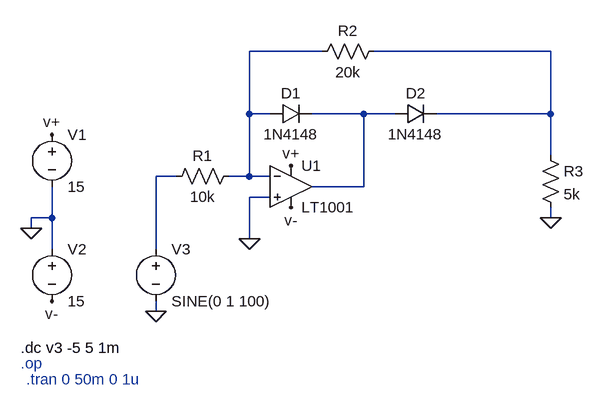
[diagram p0: schematic rectificador con ganancia.asc]
rectificador con ganancia.asc, the LTspice schematic file:
Version 4
SHEET 1 924 680
WIRE 304 -64 192 -64
WIRE 656 -64 384 -64
WIRE 192 32 192 -64
WIRE 224 32 192 32
WIRE 368 32 288 32
WIRE 416 32 368 32
WIRE 656 32 656 -64
WIRE 656 32 480 32
WIRE 656 96 656 32
WIRE 80 128 48 128
WIRE 192 128 192 32
WIRE 192 128 160 128
WIRE 224 128 192 128
WIRE 368 144 368 32
WIRE 368 144 288 144
WIRE 224 160 192 160
WIRE -112 192 -112 144
WIRE -112 192 -144 192
WIRE 656 192 656 176
WIRE -144 208 -144 192
WIRE 192 224 192 160
WIRE -112 240 -112 192
WIRE 48 240 48 128
WIRE 48 336 48 320
FLAG -144 208 0
FLAG -112 64 v+
FLAG -112 320 v-
FLAG 256 176 v-
FLAG 256 112 v+
FLAG 48 336 0
FLAG 656 192 0
FLAG 192 224 0
DATAFLAG 656 32 ""
SYMBOL OpAmps\\LT1001 256 80 R0
SYMATTR InstName U1
SYMBOL voltage -112 48 R0
WINDOW 123 0 0 Left 0
WINDOW 39 0 0 Left 0
SYMATTR InstName V1
SYMATTR Value 15
SYMBOL voltage -112 224 R0
WINDOW 123 0 0 Left 0
WINDOW 39 0 0 Left 0
SYMATTR InstName V2
SYMATTR Value 15
SYMBOL voltage 48 224 R0
WINDOW 123 0 0 Left 0
WINDOW 39 0 0 Left 0
SYMATTR InstName V3
SYMATTR Value SINE(0 1 100)
SYMBOL res 176 112 R90
WINDOW 0 0 56 VBottom 2
WINDOW 3 32 56 VTop 2
SYMATTR InstName R1
SYMATTR Value 10k
SYMBOL res 400 -80 R90
WINDOW 0 0 56 VBottom 2
WINDOW 3 32 56 VTop 2
SYMATTR InstName R2
SYMATTR Value 20k
SYMBOL diode 224 48 R270
WINDOW 0 32 32 VTop 2
WINDOW 3 0 32 VBottom 2
SYMATTR InstName D1
SYMATTR Value 1N4148
SYMBOL diode 416 48 R270
WINDOW 0 32 32 VTop 2
WINDOW 3 0 32 VBottom 2
SYMATTR InstName D2
SYMATTR Value 1N4148
SYMBOL res 640 80 R0
SYMATTR InstName R3
SYMATTR Value 5k
TEXT -160 392 Left 2 !.dc v3 -5 5 1m
TEXT -160 416 Left 2 ;.op
TEXT -152 440 Left 2 ;.tran 0 50m 0 1u

The netlist it stands for:
* rectificador con ganancia.asc
XU1 0 N001 v+ v- N003 LT1001  ; pins In+ In- V+ V- OUT
V1 v+ 0 15
V2 0 v- 15
V3 N004 0 SINE(0 1 100)
R1 N001 N004 10k
R2 N002 N001 20k
D1 N001 N003 1N4148
D2 N003 N002 1N4148
R3 N002 0 5k
.model D D
.lib standard.dio
.dc v3 -5 5 1m
* .op
* .tran 0 50m 0 1u
.lib LTC.lib
.backanno
.end